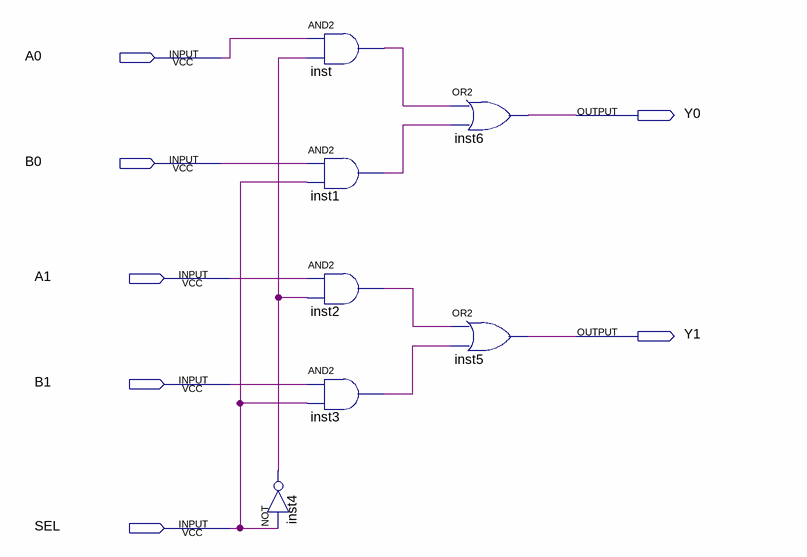
[diagram p0: schematic sheet]
// Quartus schematic MUX_2x2.bdf as structural Verilog: 7 symbols, 7 pins
module MUX_2x2 (
  input  A0,
  input  B0,
  input  A1,
  input  B1,
  input  SEL,
  output Y0,
  output Y1
);

  wire inst1_out, inst2_out, inst3_out, inst4_out, inst_out;

  not inst4 (inst4_out, SEL);
  and inst (inst_out, A0, inst4_out);
  and inst1 (inst1_out, B0, SEL);
  and inst2 (inst2_out, A1, inst4_out);
  and inst3 (inst3_out, B1, SEL);
  or inst6 (Y0, inst_out, inst1_out);
  or inst5 (Y1, inst2_out, inst3_out);
endmodule
